# Altium project Sequential_Logic_SReg_Counter.PrjPcb
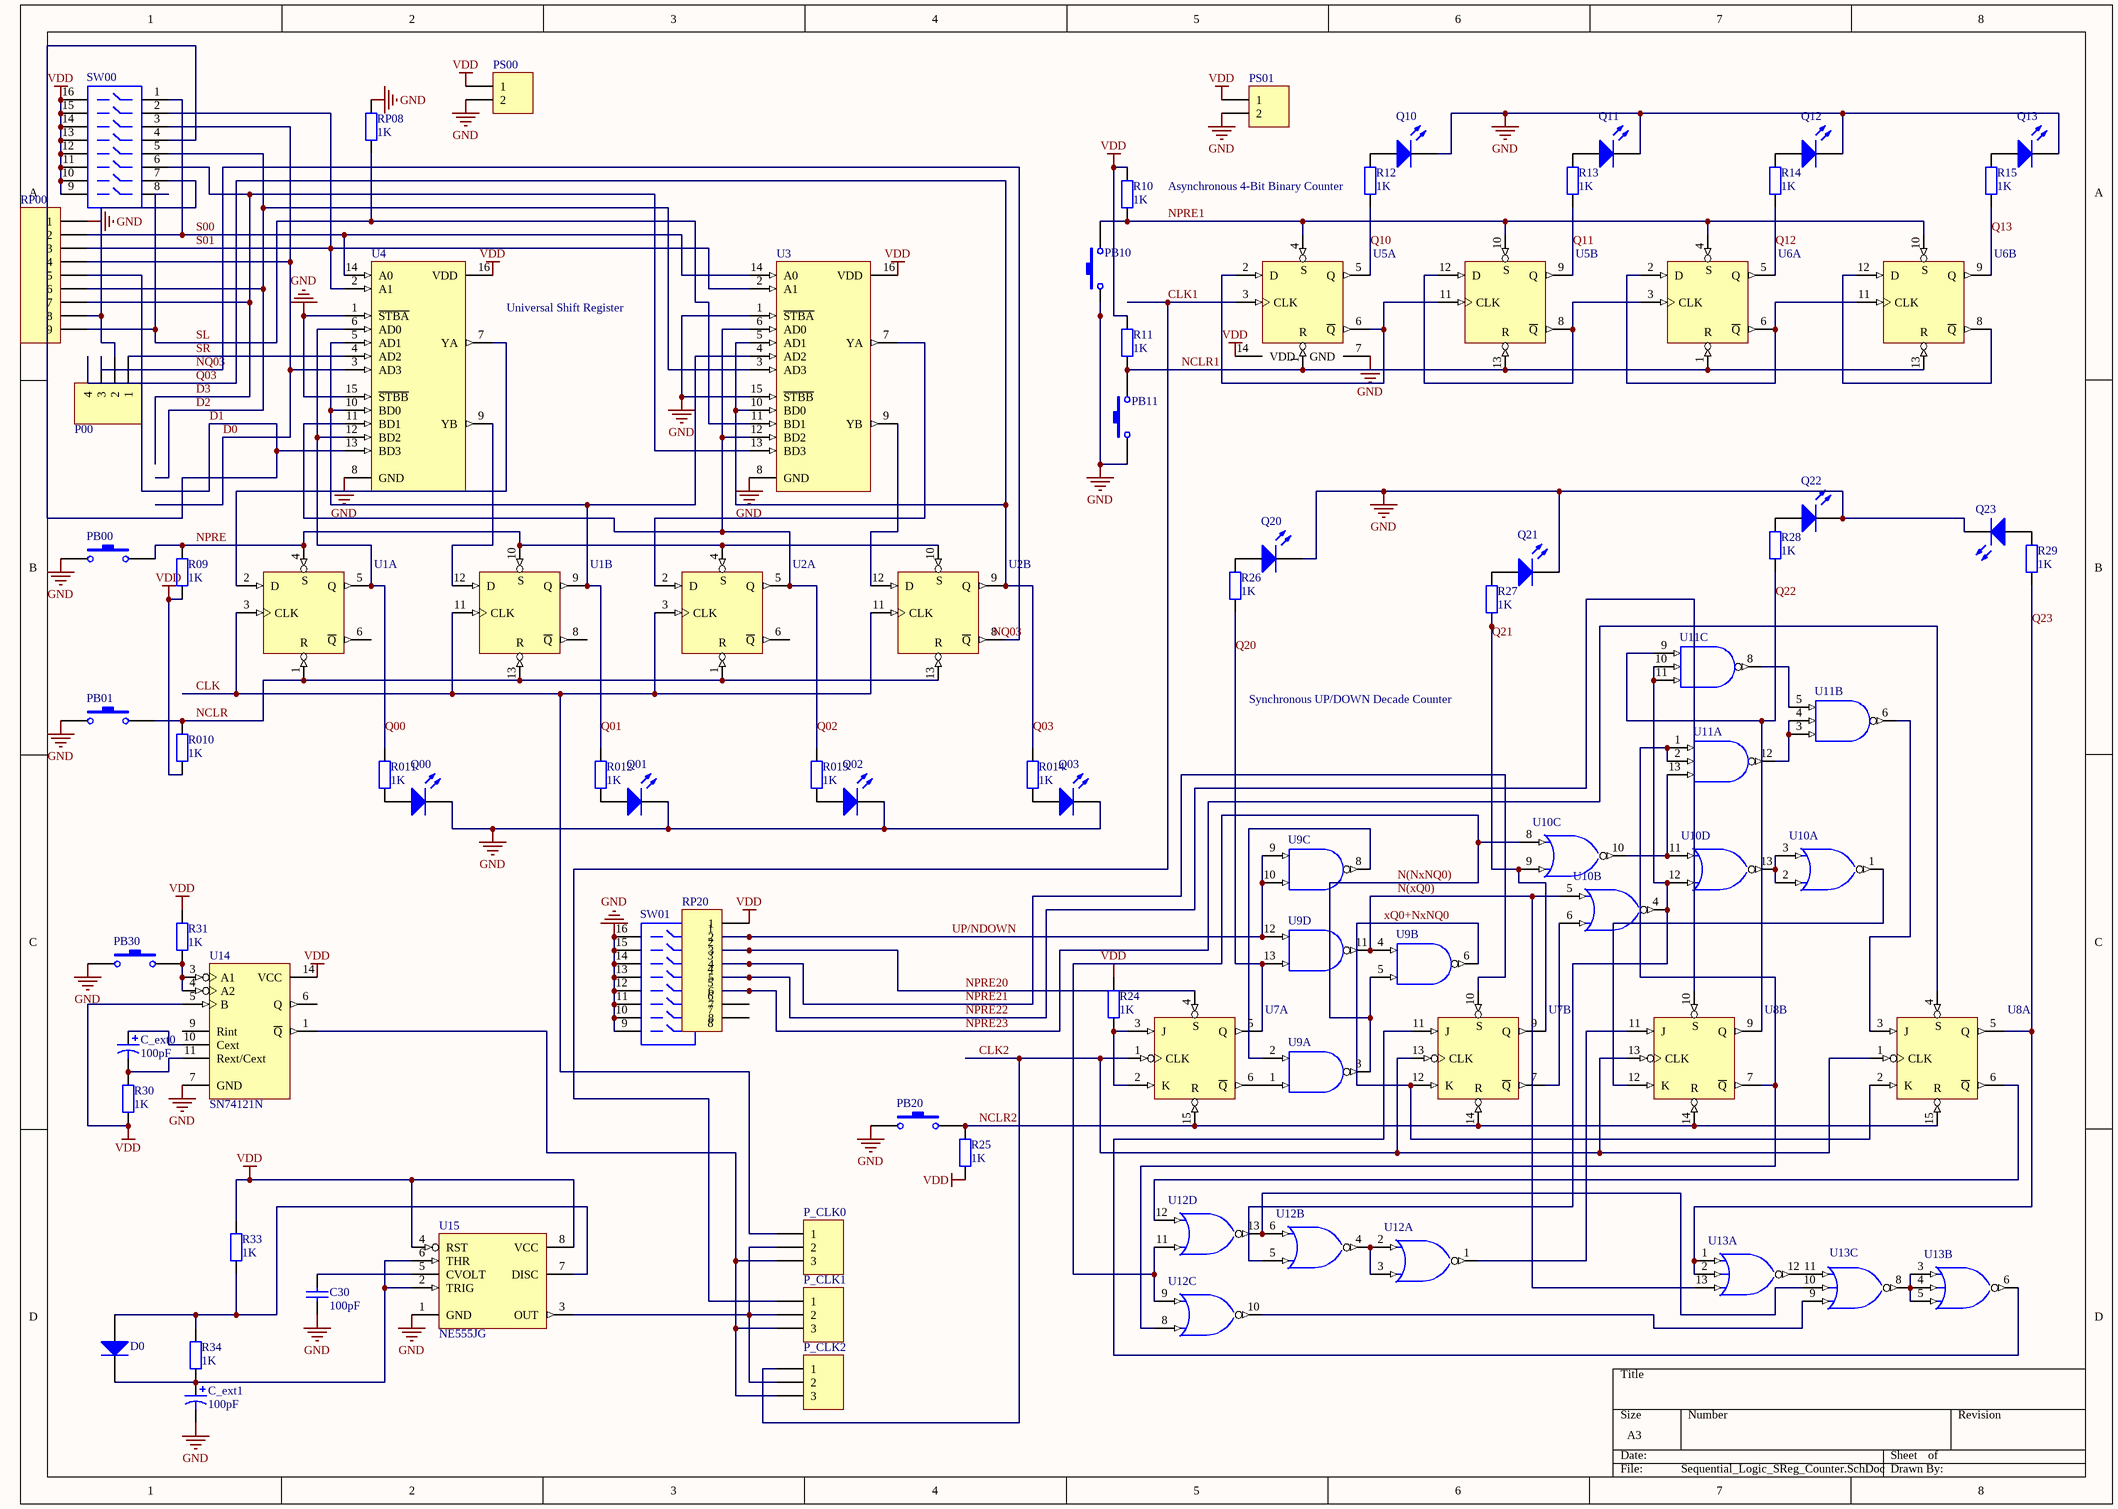
[diagram p0: Sequential_Logic_SReg_Counter.SchDoc]
1 sheet, 70 parts. Net scope: global (net labels, ports and power ports of the same name join across sheets).
Board file: Sequential_Logic_SReg_Counter.PcbDoc

## Sheet Sequential_Logic_SReg_Counter.SchDoc
size A3

### Parts
C30  100pF  [RAD-0.3]
C_ext0  100pF  [RB7.6-15]
C_ext1  100pF  [RB7.6-15]
D0  Diode 1N4007  [DO-41]  (value not drawn)
P00  Header 4  [HDR1X4]  (value not drawn)
P_CLK0  Header 3  [HDR1X3]  (value not drawn)
P_CLK1  Header 3  [HDR1X3]  (value not drawn)
P_CLK2  Header 3  [HDR1X3]  (value not drawn)
PB00  SW-PB  [SPST-2]  (value not drawn)
PB01  SW-PB  [SPST-2]  (value not drawn)
PB10  SW-PB  [SPST-2]  (value not drawn)
PB11  SW-PB  [SPST-2]  (value not drawn)
PB20  SW-PB  [SPST-2]  (value not drawn)
PB30  SW-PB  [SPST-2]  (value not drawn)
PS00  Header 2  [HDR1X2]  (value not drawn)
PS01  Header 2  [HDR1X2]  (value not drawn)
Q00  LED0  [LED-0]  (value not drawn)
Q01  LED0  [LED-0]  (value not drawn)
Q02  LED0  [LED-0]  (value not drawn)
Q03  LED0  [LED-0]  (value not drawn)
Q10  LED0  [LED-0]  (value not drawn)
Q11  LED0  [LED-0]  (value not drawn)
Q12  LED0  [LED-0]  (value not drawn)
Q13  LED0  [LED-0]  (value not drawn)
Q20  LED0  [LED-0]  (value not drawn)
Q21  LED0  [LED-0]  (value not drawn)
Q22  LED0  [LED-0]  (value not drawn)
Q23  LED0  [LED-0]  (value not drawn)
R09  1K  [AXIAL-0.4]
R010  1K  [AXIAL-0.4]
R10  1K  [AXIAL-0.4]
R011  1K  [AXIAL-0.4]
R11  1K  [AXIAL-0.4]
R012  1K  [AXIAL-0.4]
R12  1K  [AXIAL-0.4]
R013  1K  [AXIAL-0.4]
R13  1K  [AXIAL-0.4]
R014  1K  [AXIAL-0.4]
R14  1K  [AXIAL-0.4]
R15  1K  [AXIAL-0.4]
R24  1K  [AXIAL-0.4]
R25  1K  [AXIAL-0.4]
R26  1K  [AXIAL-0.4]
R27  1K  [AXIAL-0.4]
R28  1K  [AXIAL-0.4]
R29  1K  [AXIAL-0.4]
R30  1K  [AXIAL-0.4]
R31  1K  [AXIAL-0.4]
R33  1K  [AXIAL-0.4]
R34  1K  [AXIAL-0.4]
RP00  Header 9  [HDR1X9]  (value not drawn)
RP08  1K  [AXIAL-0.4]
RP20  Header 8  [HDR1X8]  (value not drawn)
SW00  SW-DIP8  [DIP-16-KEY]  (value not drawn)
SW01  SW-DIP8  [DIP-16-KEY]  (value not drawn)
U1  MC54HC74AJ  [632-08]  (value not drawn)  (parts A,B of 2)
U2  MC54HC74AJ  [632-08]  (value not drawn)  (parts A,B of 2)
U3  MC74HC153N  [648-06]  (value not drawn)
U4  MC74HC153N  [648-06]  (value not drawn)
U5  MC54HC74AJ  [632-08]  (value not drawn)  (parts A,B of 2)
U6  MC54HC74AJ  [632-08]  (value not drawn)  (parts A,B of 2)
U7  MC74HC112N  [648-06]  (value not drawn)  (parts A,B of 2)
U8  MC74HC112N  [648-06]  (value not drawn)  (parts A,B of 2)
U9  MC54HC00AJ  [632-08]  (value not drawn)  (parts A,B,C,D of 4)
U10  MC74HC02AN  [646-06]  (value not drawn)  (parts A,B,C,D of 4)
U11  MC74HC10N  [646-06]  (value not drawn)  (parts A,B,C of 3)
U12  MC54HC02AJ  [632-08]  (value not drawn)  (parts A,B,C,D of 4)
U13  MC74HC27N  [646-06]  (value not drawn)  (parts A,B,C of 3)
U14  SN74121N  [N014]
U15  NE555JG  [JG008]

### Nets
GND: C30.1 C_ext1.2 PB00.1 PB01.1 PB10.1 PB11.1 PB20.1 PB30.1 PS00.2 PS01.2 Q00.2(K) Q01.2(K) Q02.2(K) Q03.2(K) Q10.2(K) Q11.2(K) Q12.2(K) Q13.2(K) Q20.2(K) Q21.2(K) Q22.2(K) Q23.2(K) RP00.1 RP08.2 SW01.9 SW01.10 SW01.11 SW01.12 SW01.13 SW01.14 SW01.15 SW01.16 U1.7(GND) U2.7(GND) U3.1(~{STBA}) U3.8(GND) U3.15(~{STBB}) U4.1(~{STBA}) U4.8(GND) U4.15(~{STBB}) U5.7(GND) U6.7(GND) U7.8(GND) U8.8(GND) U9.7(GND) U10.7(GND) U11.7(GND) U12.7(GND) U13.7(GND) U14.7(GND) U15.1(GND)
VDD: PS00.1 PS01.1 R09.1 R010.1 R10.2 R11.2 R24.1 R25.1 R30.1 R31.2 R33.2 RP20.1 SW00.9 SW00.10 SW00.11 SW00.12 SW00.13 SW00.14 SW00.15 SW00.16 U1.14(VDD) U2.14(VDD) U3.16(VDD) U4.16(VDD) U5.14(VDD) U6.14(VDD) U7.16(VDD) U8.16(VDD) U9.14(VDD) U10.14(VDD) U11.14(VDD) U12.14(VDD) U13.14(VDD) U14.5(B) U14.14(VCC) U15.4(RST) U15.8(VCC)
CLK: P_CLK0.1 U1.3(CLK) U1.11(CLK) U2.3(CLK) U2.11(CLK)
CLK1: P_CLK1.1 U5.3(CLK)
CLK2: P_CLK2.1 U7.1(CLK) U7.13(CLK) U8.1(CLK) U8.13(CLK)
D0: RP00.4 SW00.3 U4.3(AD3)
D1: RP00.5 SW00.4 U4.13(BD3)
D2: RP00.6 SW00.5 U3.3(AD3)
D3: RP00.7 SW00.6 U3.13(BD3)
N(NxNQ0): U9.3(Y) U9.5(B) U10.8(A) U12.9(B) U12.11(A)
N(xQ0): U9.4(A) U9.11(Y) U10.5(A) U13.13(C)
NCLR: PB01.2 R010.2 U1.1(R) U1.13(R) U2.1(R) U2.13(R)
NCLR1: PB11.2 R11.1 U5.1(R) U5.13(R) U6.1(R) U6.13(R)
NCLR2: PB20.2 R25.2 U7.14(R) U7.15(R) U8.14(R) U8.15(R)
NPRE: PB00.2 R09.2 U1.4(S) U1.10(S) U2.4(S) U2.10(S)
NPRE1: PB10.2 R10.1 U5.4(S) U5.10(S) U6.4(S) U6.10(S)
NPRE20: RP20.3 SW01.2 U7.4(S)
NPRE21: RP20.4 SW01.3 U7.10(S)
NPRE22: RP20.5 SW01.4 U8.10(S)
NPRE23: RP20.6 SW01.5 U8.4(S)
NQ03: P00.3 U2.8(~{Q})
Q00: R011.2 U1.5(Q) U4.6(AD0) U4.12(BD2)
Q01: R012.2 U1.9(Q) U3.4(AD2) U4.5(AD1) U4.10(BD0)
Q02: R013.2 U2.5(Q) U3.6(AD0) U3.12(BD2) U4.11(BD1)
Q03: P00.4 R014.2 U2.9(Q) U3.5(AD1) U3.10(BD0)
Q10: R12.1 U5.5(Q)
Q11: R13.1 U5.9(Q)
Q12: R14.1 U6.5(Q)
Q13: R15.1 U6.9(Q)
Q20: R26.1 U7.5(Q) U9.13(B)
Q21: R27.1 U7.9(Q) U10.9(B)
Q22: R28.1 U8.9(Q) U11.9(A)
Q23: R29.1 U8.5(Q) U13.1(A) U13.2(B)
S00: RP00.2 SW00.1 U3.14(A0) U4.14(A0)
S01: RP00.3 SW00.2 U3.2(A1) U4.2(A1)
SL: RP00.9 RP08.1 SW00.8 U3.11(BD1)
SR: P00.1 U4.4(AD2)
UP/NDOWN: RP20.2 SW01.1 U9.9(A) U9.10(B) U9.12(A)
xQ0+NxNQ0: U7.12(K) U8.2(K) U9.6(Y)
NetC30_2: C30.2 U15.5(CVOLT)
NetC_ext0_1: C_ext0.1 U14.10(Cext)
NetC_ext0_2: C_ext0.2 R30.2 U14.11(Rext/Cext)
NetC_ext1_1: C_ext1.1 D0.2(K) R34.1 U15.2(TRIG) U15.6(THR)
NetD0_1: D0.1(A) R33.1 R34.2 U15.7(DISC)
NetP00_2: P00.2 RP00.8 SW00.7
NetP_CLK0_2: P_CLK0.2 P_CLK1.2 P_CLK2.2 U15.3(OUT)
NetP_CLK0_3: P_CLK0.3 P_CLK1.3 P_CLK2.3 U14.1(~{Q})
NetPB30_2: PB30.2 R31.1 U14.3(A1) U14.4(A2)
NetQ00_1: Q00.1(A) R011.1
NetQ01_1: Q01.1(A) R012.1
NetQ02_1: Q02.1(A) R013.1
NetQ03_1: Q03.1(A) R014.1
NetQ10_1: Q10.1(A) R12.2
NetQ11_1: Q11.1(A) R13.2
NetQ12_1: Q12.1(A) R14.2
NetQ13_1: Q13.1(A) R15.2
NetQ20_1: Q20.1(A) R26.2
NetQ21_1: Q21.1(A) R27.2
NetQ22_1: Q22.1(A) R28.2
NetQ23_1: Q23.1(A) R29.2
NetR24_2: R24.2 U7.2(K) U7.3(J)
NetU1_2: U1.2(D) U4.7(YA)
NetU1_12: U1.12(D) U4.9(YB)
NetU2_2: U2.2(D) U3.7(YA)
NetU2_12: U2.12(D) U3.9(YB)
NetU5_2: U5.2(D) U5.6(~{Q}) U5.11(CLK)
NetU5_8: U5.8(~{Q}) U5.12(D) U6.3(CLK)
NetU6_2: U6.2(D) U6.6(~{Q}) U6.11(CLK)
NetU6_8: U6.8(~{Q}) U6.12(D)
NetU7_6: U7.6(~{Q}) U9.1(A)
NetU7_7: U7.7(~{Q}) U10.6(B)
NetU7_11: U7.11(J) U13.6(Y)
NetU8_3: U8.3(J) U11.6(Y)
NetU8_6: U8.6(~{Q}) U12.12(B)
NetU8_7: U8.7(~{Q}) U11.1(A) U11.2(B) U12.8(A)
NetU8_11: U8.11(J) U12.1(Y)
NetU8_12: U8.12(K) U10.1(Y)
NetU9_2: U9.2(B) U9.8(Y)
NetU10_2: U10.2(A) U10.3(B) U10.13(Y)
NetU10_4: U10.4(Y) U10.12(B) U11.10(B) U11.11(C) U12.5(A)
NetU10_10: U10.10(Y) U10.11(A) U11.13(C)
NetU11_3: U11.3(A) U11.4(B) U11.12(Y)
NetU11_5: U11.5(C) U11.8(Y)
NetU12_2: U12.2(A) U12.3(B) U12.4(Y)
NetU12_6: U12.6(B) U12.13(Y) U13.10(B)
NetU12_10: U12.10(Y) U13.9(A)
NetU13_3: U13.3(A) U13.4(B) U13.5(C) U13.8(Y)
NetU13_11: U13.11(C) U13.12(Y)

Not connected (* = marked no-connect by the designer): RP20 7 8; SW01 6 7 8; U1 6(~{Q}) 8(~{Q}); U2 6(~{Q}); U14 6(Q) 9(Rint)

### Notes on the sheet
- (near R12) Asynchronous 4-Bit Binary Counter
- (near U4) Universal Shift Register
- Synchronous UP/DOWN Decade Counter
- Labels drawn without touching a wire or pin: NQ03

### Library data of the parts
C30 = Cap: Capacitor; Published: 8-Jun-2000; LatestRevisionDate: 17-Jul-2002; LatestRevisionNote: Re-released for DXP Platform.; PackageReference: RAD-0.3; Publisher: Altium Limited; PackageDescription: Radial Cap, Thru-Hole; 2 Leads; 0.3 in Pin Spacing; Value: 100pF
C_ext0 C_ext1 = Cap Pol1: Polarized Capacitor (Radial); Published: 8-Jun-2000; LatestRevisionDate: 17-Jul-2002; LatestRevisionNote: Re-released for DXP Platform.; PackageReference: RB7.6-15; Publisher: Altium Limited; PackageDescription: Polarized Capacitor (Radial); 2 Leads; Value: 100pF
D0 = Diode 1N4007: 1 Amp General Purpose Rectifier; Published: 8-Jun-2000; LatestRevisionDate: 17-Jul-2002; LatestRevisionNote: Re-released for DXP Platform.; DatasheetVersion: 1998; PackageVersion: Aug-1999; PackageReference: DO-41; Publisher: Altium Limited; PackageDescription: Diode, Axial; Body 5.2 x 2.7 mm (LxDia. max), Lead Dia. 0.86 mm (max); Code_JEDEC: DO-204-AL; ComponentLink1Description: Manufacturer Link; ComponentLink1URL: http://www.fairchildsemi.com/; ComponentLink2Description: Datasheet; ComponentLink2URL: http://www.fairchildsemi.com/ds/1N%2F1N4001.pdf
P00 = Header 4: Header, 4-Pin; LatestRevisionDate: 17-Jul-2002; LatestRevisionNote: Re-released for DXP Platform.; Publisher: Altium Limited
P_CLK0-P_CLK2 = Header 3: Header, 3-Pin; LatestRevisionDate: 17-Jul-2002; LatestRevisionNote: Re-released for DXP Platform.; Publisher: Altium Limited
PB00 PB01 PB10 PB11 PB20 PB30 = SW-PB: Switch; Published: 24-Mar-1999; LatestRevisionDate: 17-Jul-2002; LatestRevisionNote: Re-released for DXP Platform.; PackageReference: SPST-2; Publisher: Altium Limited; PackageDescription: Switch; 2 Leads
PS00 PS01 = Header 2: Header, 2-Pin; LatestRevisionDate: 17-Jul-2002; LatestRevisionNote: Re-released for DXP Platform.; Publisher: Altium Limited
Q00 Q01 Q02 Q03 Q10-Q13 Q20-Q23 = LED0: Typical INFRARED GaAs LED; Published: 8-Jun-2000; LatestRevisionDate: 08-Jul-2005; LatestRevisionNote: Mech Layer 1 removed.; PackageReference: LED-0; Publisher: Altium Limited; PackageDescription: LED; 2 Leads
R09 R010 R10 R011 R11 R012 R12 R013 R13 R014 R14 R15 R24-R31 R33 R34 RP08 = Res2: Resistor; Published: 8-Jun-2000; LatestRevisionDate: 17-Jul-2002; LatestRevisionNote: Re-released for DXP Platform.; PackageReference: AXIAL-0.4; Publisher: Altium Limited; PackageDescription: Axial Device, Thru-Hole; 2 Leads; 0.4 in Pin Spacing; Value: 1K
RP00 = Header 9: Header, 9-Pin; LatestRevisionDate: 17-Jul-2002; LatestRevisionNote: Re-released for DXP Platform.; Publisher: Altium Limited
RP20 = Header 8: Header, 8-Pin; LatestRevisionDate: 17-Jul-2002; LatestRevisionNote: Re-released for DXP Platform.; Publisher: Altium Limited
SW00 SW01 = SW-DIP8: 4009 Series DIP Switch, Raised actuator; Published: 24-Mar-1999; LatestRevisionDate: 17-Dec-2003; LatestRevisionNote: PCB Footprint replaced.; PackageReference: DIP-16-KEY; Publisher: Altium Limited; PackageDescription: DIP; 16 Leads; Row Spacing 7.62 mm; Pitch 2.54 mm; ComponentLink1Description: Manufacturer Link; ComponentLink1URL: http://www.oupiin.com/prodindx.html#Headers
U1 U2 U5 U6 = MC54HC74AJ: Dual D-Type Flip-Flop with Set and Reset; Published: 17-Jul-2002; LatestRevisionDate: 06-Jun-2005; LatestRevisionNote: Stylized 3D Model Added; DatasheetVersion: 1989; PackageReference: 632-08; Publisher: Altium Limited; PackageDescription: DIP; 14 Leads; Row Spacing 7.62 mm; Pitch 2.54 mm; ComponentLink1Description: Manufacturer Link; ComponentLink1URL: http://www.onsemi.com/site/products/parametrics/0,4446,238,00.html; ComponentLink2Description: Ibis Model; ComponentLink2URL: http://www.onsemi.com/pub/Collateral/MC54HC74AJ.IBS
U3 U4 = MC74HC153N: Dual 4-Input Data Selector/Multiplexer; Published: 17-Jul-2002; LatestRevisionDate: 06-Jun-2005; LatestRevisionNote: Stylized 3D Model Added; DatasheetVersion: 1989; PackageReference: 648-06; Publisher: Altium Limited; PackageDescription: DIP; 16 Leads; Row Spacing 7.62 mm; Pitch 2.54 mm; ComponentLink1Description: Manufacturer Link; ComponentLink1URL: http://www.onsemi.com/site/products/parametrics/0,4446,419,00.html; ComponentLink2Description: Ibis Model; ComponentLink2URL: http://www.onsemi.com/pub/Collateral/MC54HC153J.IBS
U7 U8 = MC74HC112N: Dual J-K Flip-Flop with Set and Reset; Published: 17-Jul-2002; LatestRevisionDate: 06-Jun-2005; LatestRevisionNote: Stylized 3D Model Added; DatasheetVersion: 1989; PackageReference: 648-06; Publisher: Altium Limited; PackageDescription: DIP; 16 Leads; Row Spacing 7.62 mm; Pitch 2.54 mm; ComponentLink1Description: Manufacturer Link; ComponentLink1URL: http://www.onsemi.com/site/products/parametrics/0,4446,238,00.html
U9 = MC54HC00AJ: Quad 2-Input NAND Gate; Published: 17-Jul-2002; LatestRevisionDate: 06-Jun-2005; LatestRevisionNote: Stylized 3D Model Added; DatasheetVersion: 1989; PackageReference: 632-08; Publisher: Altium Limited; PackageDescription: DIP; 14 Leads; Row Spacing 7.62 mm; Pitch 2.54 mm; ComponentLink1Description: Manufacturer Link; ComponentLink1URL: http://www.onsemi.com/site/products/parametrics/0,4446,247,00.html; ComponentLink2Description: Ibis Model; ComponentLink2URL: http://www.onsemi.com/pub/Collateral/MC54HC00AJ.IBS
U10 = MC74HC02AN: Quad 2-Input NOR Gate; Published: 17-Jul-2002; LatestRevisionDate: 06-Jun-2005; LatestRevisionNote: Stylized 3D Model Added; DatasheetVersion: 1989; PackageVersion: 1997; PackageReference: 646-06; Publisher: Altium Limited; PackageDescription: DIP; 14 Leads; Row Spacing 7.62 mm; Pitch 2.54 mm; ComponentLink1Description: Manufacturer Link; ComponentLink1URL: http://www.onsemi.com/site/products/parametrics/0,4446,247,00.html; ComponentLink2Description: Ibis Model; ComponentLink2URL: http://www.onsemi.com/pub/Collateral/MC54HC02AJ.IBS
U11 = MC74HC10N: Triple 3-Input NAND Gate; Published: 17-Jul-2002; LatestRevisionDate: 06-Jun-2005; LatestRevisionNote: Stylized 3D Model Added; DatasheetVersion: 1989; PackageVersion: 1997; PackageReference: 646-06; Publisher: Altium Limited; PackageDescription: DIP; 14 Leads; Row Spacing 7.62 mm; Pitch 2.54 mm; ComponentLink1Description: Manufacturer Link; ComponentLink1URL: http://www.onsemi.com/site/products/parametrics/0,4446,247,00.html; ComponentLink2Description: Ibis Model; ComponentLink2URL: http://www.onsemi.com/pub/Collateral/MC54HC10J.IBS
U12 = MC54HC02AJ: Quad 2-Input NOR Gate; Published: 17-Jul-2002; LatestRevisionDate: 06-Jun-2005; LatestRevisionNote: Stylized 3D Model Added; DatasheetVersion: 1989; PackageReference: 632-08; Publisher: Altium Limited; PackageDescription: DIP; 14 Leads; Row Spacing 7.62 mm; Pitch 2.54 mm; ComponentLink1Description: Manufacturer Link; ComponentLink1URL: http://www.onsemi.com/site/products/parametrics/0,4446,247,00.html; ComponentLink2Description: Ibis Model; ComponentLink2URL: http://www.onsemi.com/pub/Collateral/MC54HC02AJ.IBS
U13 = MC74HC27N: Triple 3-Input NOR Gate; Published: 17-Jul-2002; LatestRevisionDate: 06-Jun-2005; LatestRevisionNote: Stylized 3D Model Added; DatasheetVersion: 1989; PackageVersion: 1997; PackageReference: 646-06; Publisher: Altium Limited; PackageDescription: DIP; 14 Leads; Row Spacing 7.62 mm; Pitch 2.54 mm; ComponentLink1Description: Manufacturer Link; ComponentLink1URL: http://www.onsemi.com/site/products/parametrics/0,4446,247,00.html; ComponentLink2Description: Ibis Model; ComponentLink2URL: http://www.onsemi.com/pub/Collateral/MC54HC27J.IBS
U14 = SN74121N: Monostable Multivibrator with Schmitt-Trigger Inputs; Note: Pins No 2,8,12 and 13 are not connected and not drawn; Published: 8-Jun-2000; LatestRevisionDate: 04-Mar-2005; LatestRevisionNote: Stylized 3D Model Added.; DatasheetVersion: Mar-1988; PackageVersion: Oct-1995; PackageReference: N014; Publisher: Altium Limited; PackageDescription: DIP; 14 Leads; Row Spacing 7.62 mm; Pitch 2.54 mm; ComponentLink1Description: Manufacturer Link; ComponentLink1URL: http://www.ti.com/; ComponentLink2Description: Datasheet; ComponentLink2URL: http://www-s.ti.com/sc/ds/sn74121.pdf
U15 = NE555JG: Precision Timer; Published: 16-Jan-2001; LatestRevisionDate: 04-Mar-2005; LatestRevisionNote: Stylized 3D Model Added.; DatasheetVersion: Feb-1992; PackageVersion: Jan-1995; PackageReference: JG008; Publisher: Altium Limited; PackageDescription: DIP; 8 Leads; Row Spacing 7.62 mm; Pitch 2.54 mm; ComponentLink1Description: Manufacturer Link; ComponentLink1URL: http://www.ti.com/; ComponentLink2Description: Datasheet; ComponentLink2URL: http://www-s.ti.com/sc/ds/ne555.pdf